# EAGLE design Font _light_connect (EAGLE 8.3.1)
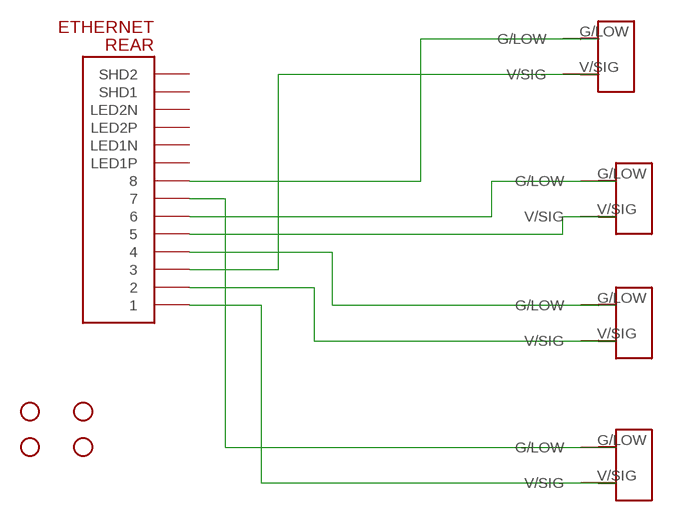
[diagram p0: schematic, sheet 1]

## Parts
H1  STAND-OFF  [STAND-OFF]
H2  STAND-OFF  [STAND-OFF]
H3  STAND-OFF  [STAND-OFF]
H4  STAND-OFF  [STAND-OFF]
L_DRIVE  2_PIN_TECONNECTOR  [2_PIN_CONNECT]
L_SIG  2_PIN_TECONNECTOR  [2_PIN_CONNECT]
R_SIG  2_PIN_TECONNECTOR  [2_PIN_CONNECT]
REAR  ETHERNET  [A122645-ND]
T_DRIVE  2_PIN_TECONNECTOR  [2_PIN_CONNECT]

## Nets
N$1: L_DRIVE.V/SIG REAR.P$1
N$2: L_SIG.V/SIG REAR.P$2
N$3: R_SIG.V/SIG REAR.P$5
N$4: L_SIG.G/LOW REAR.P$4
N$5: L_DRIVE.G/LOW REAR.P$7
N$6: R_SIG.G/LOW REAR.P$6
N$7: REAR.P$3 T_DRIVE.V/SIG
N$8: REAR.P$8 T_DRIVE.G/LOW
Unconnected: REAR.P$9(LED1N) REAR.P$10(LED1P) REAR.P$11(LED2N) REAR.P$12(LED2P) REAR.P$13(SHD1) REAR.P$14(SHD2)

## Library data of the parts
H1-H4 = SparkFun-Electromechanical:STAND-OFF: #4 Stand Off This is the mechanical footprint for a #4 phillips button head screw. Use the keepout ring to avoid running the screw head into surrounding components. SKU : PRT-00447
L_DRIVE L_SIG R_SIG T_DRIVE = TE 2-pin connector:2_PIN_TECONNECTOR: 2-pin connector for high power connections on board
REAR = ETHERNET:ETHERNET: Ethernet port with 2 leds. digikey number A122645-ND

## Board
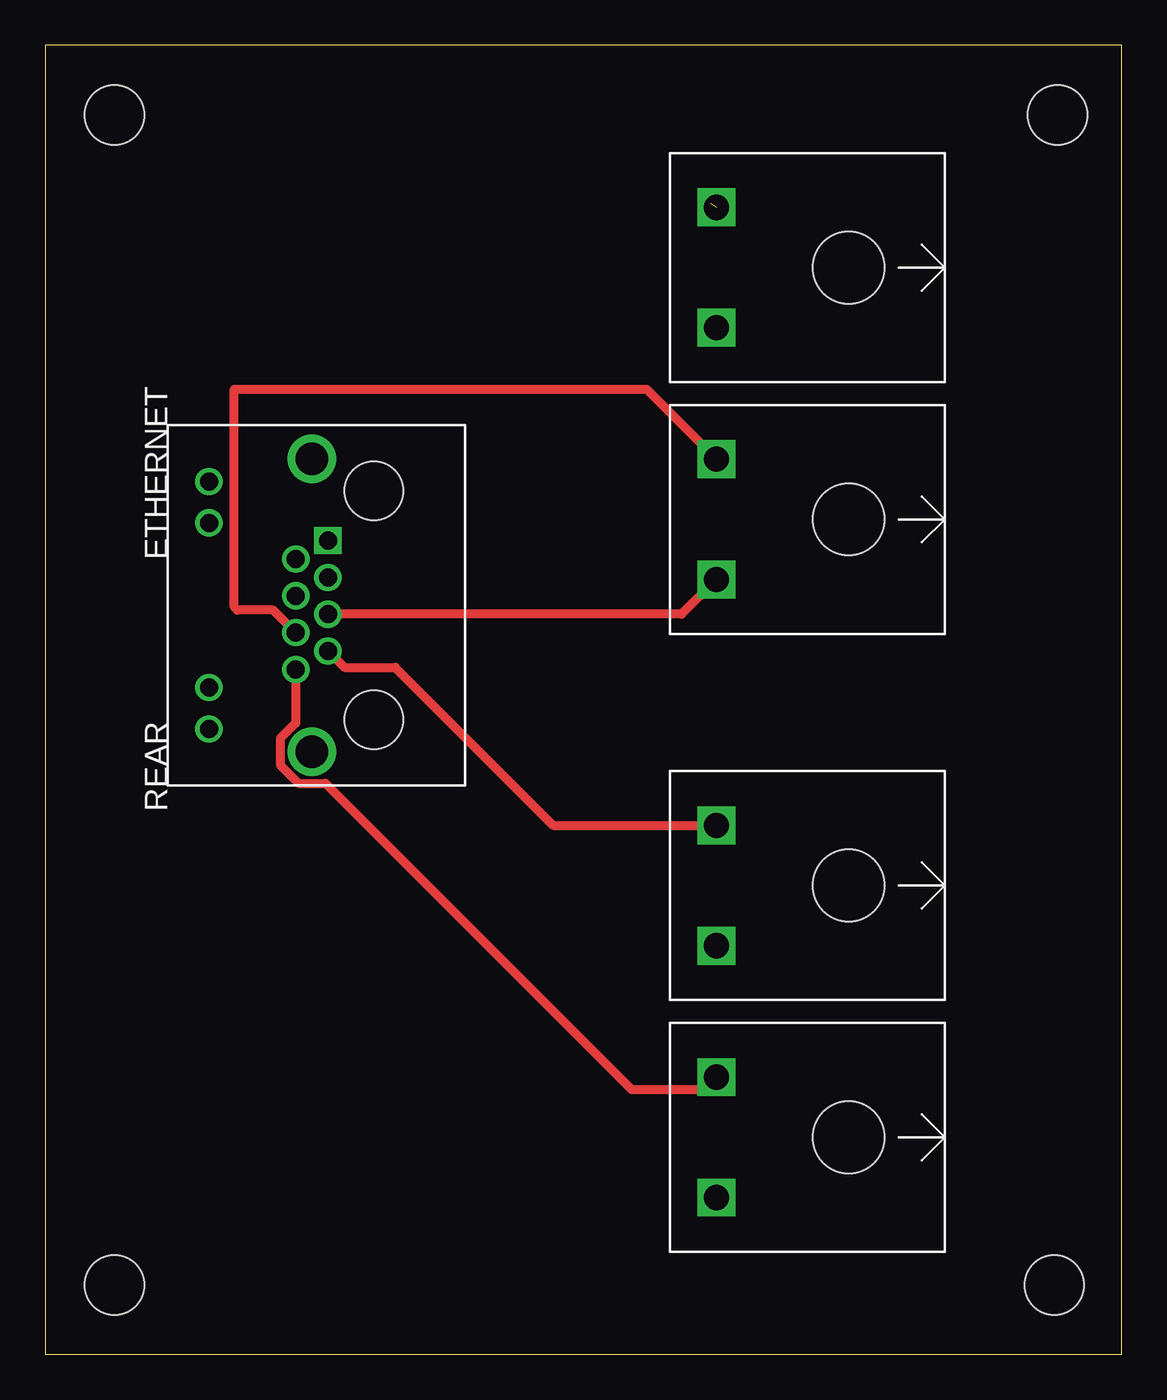
[diagram p1: board, top side]
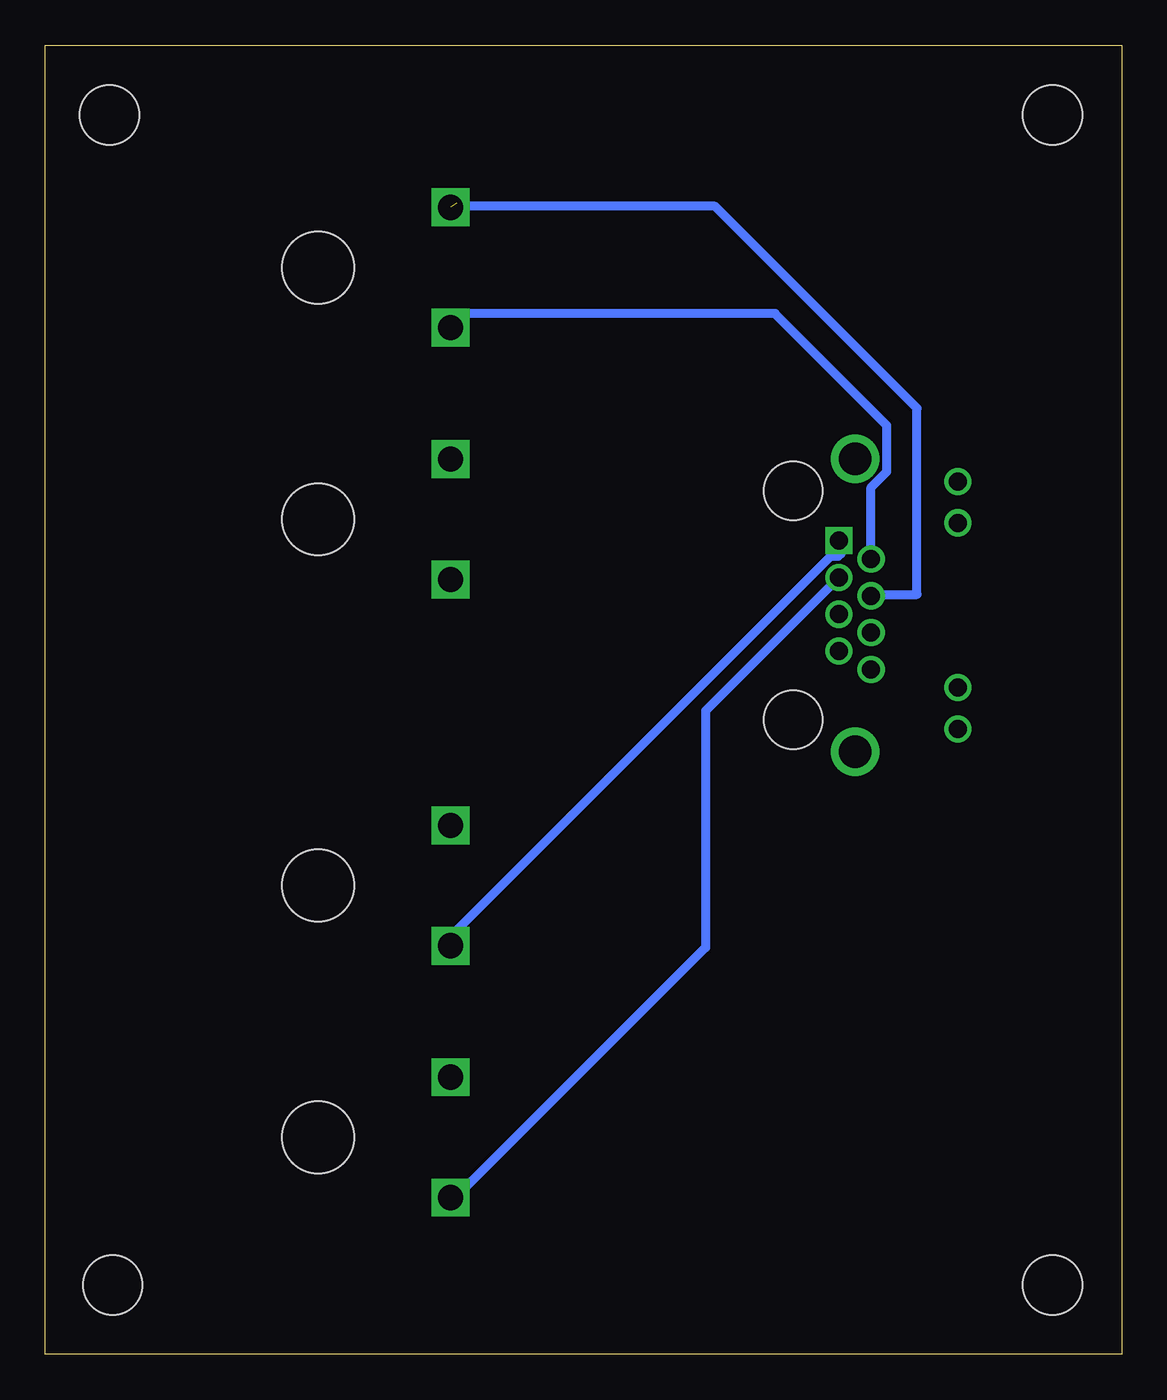
[diagram p2: board, bottom side, seen from below]

Size 59.75 x 72.65 mm. Coordinates in mm from the lower left corner, seen from the top.
Outline: 0,0 59.75,0 59.75,72.65 0,72.65 0,0
Copper layers (1*16): Top 0.035mm / dielectric 1.5mm / Bottom 0.035mm
Design rules "default": minimum track width 6mil, minimum drill 0.35mm, track to track 6mil, track to pad 6mil, pad to pad 6mil, via to via 6mil, smd to smd 6mil, copper to edge 40mil, drill to drill 6mil, minimum pad ring 10mil, minimum via ring 8mil, stop-mask expansion 4mil, vias tented up to drill 0mil, thermal gap 10mil

### Footprints (pad centres in the part's own frame; a part is rotated, then mirrored left to right if it is on the bottom)
STAND-OFF = hole 3.302: 0,0
2_PIN_CONNECT = drill 1.4 square: G/LOW 3.34,12.67; V/SIG -3.34,12.67 | hole 4: 0,5.33
A122645-ND = drill 1 square: P$1 3.58,2.54 | drill 1: P$2 2.56,4.32; P$3 1.54,2.54; P$4 0.52,4.32; P$5 -0.5,2.54; P$6 -1.52,4.32; P$7 -2.54,2.54; P$8 -3.56,4.32; P$9 -6.86,9.14; P$10 -4.57,9.14; P$11 4.57,9.14; P$12 6.86,9.14 | drill 1.8: P$13 -8.13,3.43; P$14 8.13,3.43 | hole 3.25: -6.35,0; 6.35,0

### Placement (x,y rotation side)
H1  3.85,3.85 0 top
H2  56,3.85 0 top
H3  3.85,68.78 0 top
H4  56.17,68.78 0 top
L_DRIVE  49.92,26.02 90 top
L_SIG  49.92,60.3 90 top
R_SIG  49.92,46.34 90 top
REAR  18.23,41.57 90 top
T_DRIVE  49.92,12.04 90 top

### Tracks (layer width: path | path; a pad name or v marks a point on that pad's centre or on a via)
N$1
  Bottom 0.508: 36.75,22.75 36.83,22.68 L_DRIVE.V/SIG 37.25,23.2 16.18,44.27 15.76,44.27 15.58,44.45 15.58,45.03 REAR.P$1
N$2
  Bottom 0.508: REAR.P$2 13.91,48.11 13.05,48.97 13.05,51.55 19.25,57.75 37.28,57.75 37.62,57.4 37.62,57.34 L_SIG.V/SIG
N$3
  Top 0.508: REAR.P$5 35.33,41.07 R_SIG.V/SIG 37.25,43.08 36.75,43.58
N$4  (1 unrouted)
  Bottom 0.508: REAR.P$4 13.83,42.18 11.38,42.18 11.38,52.5 22.58,63.7 36.75,63.7 | 36.75,63.7 37.8,63.7 37.97,63.88 36.92,63.88 36.75,63.7
N$5
  Top 0.508: REAR.P$7 16.61,38.12 19.43,38.12 28.19,29.36 L_DRIVE.G/LOW
N$6
  Top 0.508: REAR.P$6 12.66,41.3 10.67,41.3 10.5,41.48 10.5,53.55 33.38,53.55 R_SIG.G/LOW
  Bottom 0.508: REAR.P$6 13.91,39.65
N$7
  Bottom 0.508: REAR.P$3 23.1,35.71 23.1,22.57 36.97,8.71 T_DRIVE.V/SIG
N$8
  Top 0.508: REAR.P$8 13.91,35.03 13.05,34.17 13.05,32.71 14.08,31.68 15.57,31.68 32.55,14.7 36.56,14.7 T_DRIVE.G/LOW